# Altium schematic sheet 34.SchDoc
size 513 x 386 mm
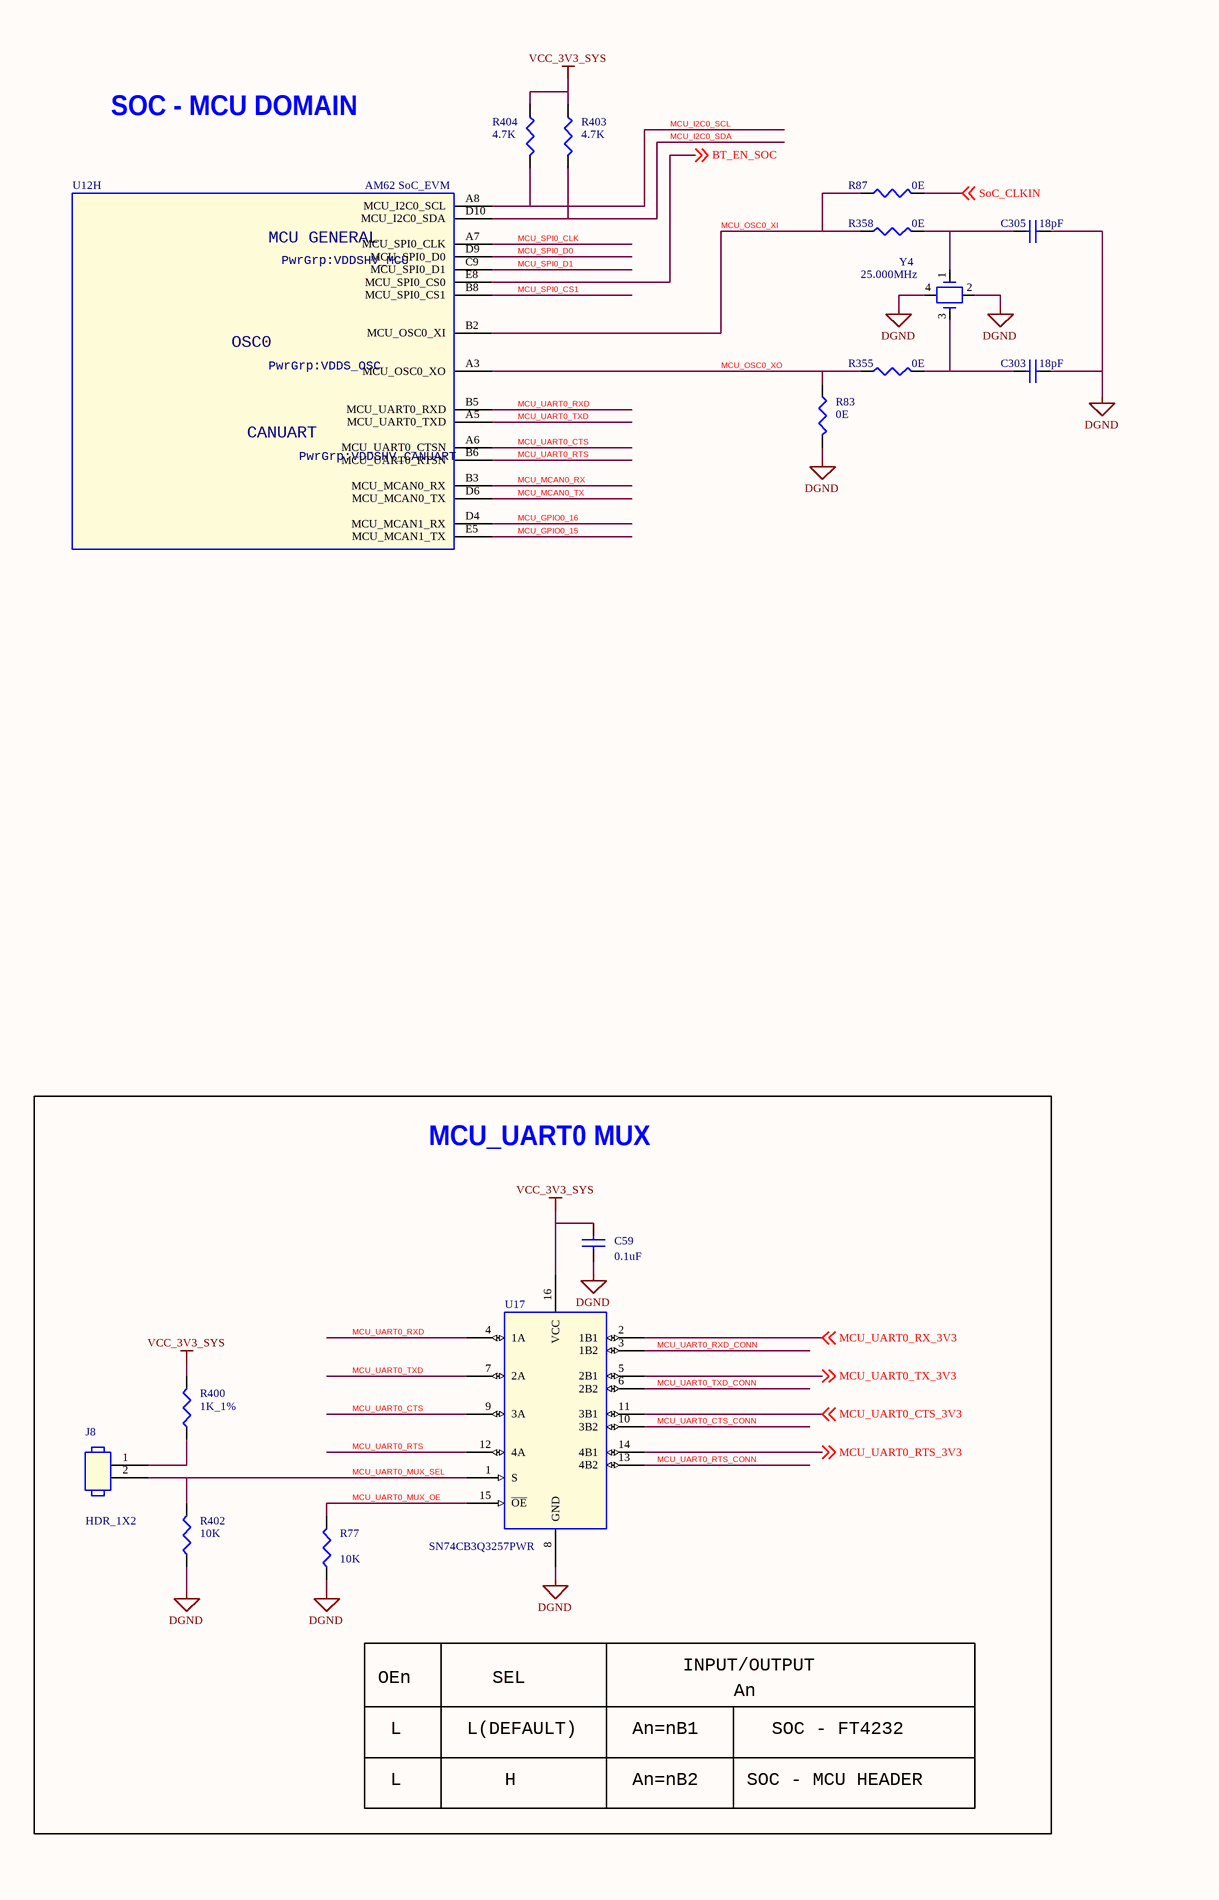
[diagram p0: 34.SchDoc, left]
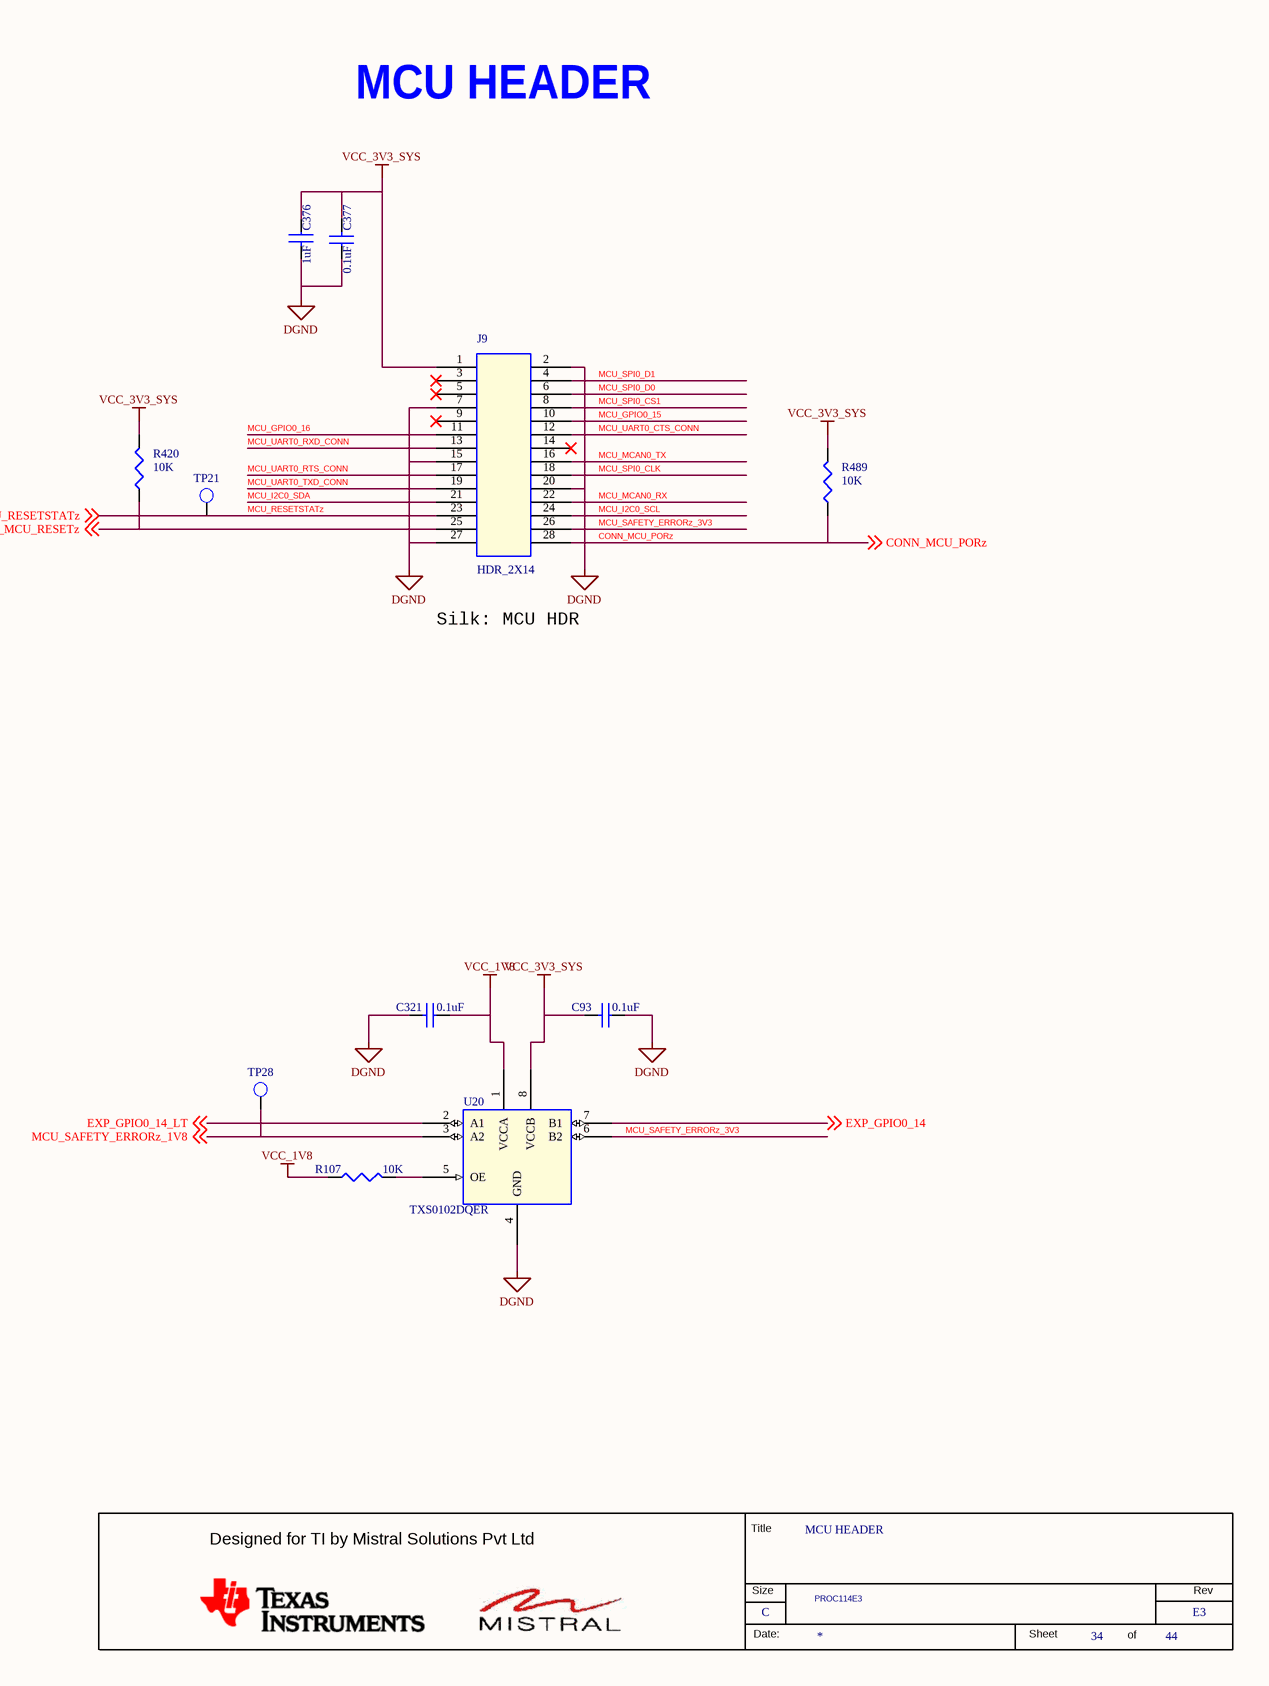
[diagram p1: 34.SchDoc, right]

## Parts
*  RevCode: E3  Title: MCU HEADER  Page Size: C  Page Number: 34  Page Count: 44  Variant Name: PROC114E3  (hidden comment: MISTRAL_TITLEBLK_CSIZE)  (graphical)
C59  0.1uF  [CAP0402_0-75]
C93  0.1uF  [CAP0201_0-5]
C303  18pF  [CAP0402_0-75]
C305  18pF  [CAP0402_0-75]
C321  0.1uF  [CAP0201_0-5]
C376  1uF  [CAP0201_0-5]
C377  0.1uF  [CAP0402_0-75]
J8  HDR_1X2  [HDR_1X2_90120-0122_S_T_5-6]
J9  HDR_2X14  [HDR_14X2_100_S_T]
R77  10K  [RES0201_0-5]
R83  0E  [RES0201_0-5]
R87  0E  [RES0201_0-5]
R107  10K  [RES0201_0-5]
R355  0E  [RES0402_0-5]
R358  0E  [RES0402_0-5]
R400  1K_1%  [RES0402_0-5]
R402  10K  [RES0201_0-5]
R403  4.7K  [RES0201_0-5]
R404  4.7K  [RES0201_0-5]
R420  10K  [RES0201_0-5]
R489  10K  [RES0201_0-5]
TP21  TP20_SMD  [TP20_SMD]  (value not drawn)
TP28  TP20_SMD  [TP20_SMD]  (value not drawn)
U12  AM62 SoC_EVM  [BGA425_19-68_510X510_0-7]  (part H of 18)
U17  SN74CB3Q3257PWR  [TSSOP16_25-59_205X180]
U20  TXS0102DQER  [X2SON8_TXS0102_40X60_0-4]
Y4  25.000MHz  [XTAL4_XRCGB-FM_80X60_SMD_0-7]

## Blocks framed on the sheet
MCU_UART0 MUX: C59 J8 R77 R400 R402 U17

## Nets
DGND: C59.1 C93.1 C303.1 C305.1 C321.2 C376.2 C377.1 J9.2 J9.7 J9.15 J9.20 J9.27 R77.2 R83.1 R402.1 U17.8(GND) U20.4(GND) Y4.2 Y4.4
VCC_1V8: C321.1 R107.1 U20.1(VCCA)
VCC_3V3_SYS: C59.2 C93.2 C376.1 C377.2 J9.1 R400.2 R403.1 R404.1 R420.2 R489.2 U17.16(VCC) U20.8(VCCB)
BT_EN_SOC: U12.E8(MCU_SPI0_CS0) ; off-sheet BT_EN_SOC
CONN_MCU_PORz: J9.28 R489.1 ; off-sheet CONN_MCU_PORz
CONN_MCU_RESETz: J9.25 R420.1 ; off-sheet CONN_MCU_RESETz
EXP_GPIO0_14: U20.7(B1) ; off-sheet EXP_GPIO0_14
EXP_GPIO0_14_LT: U20.2(A1) ; off-sheet EXP_GPIO0_14_LT
MCU_GPIO0_15: J9.10 U12.E5(MCU_MCAN1_TX)
MCU_GPIO0_16: J9.11 U12.D4(MCU_MCAN1_RX)
MCU_I2C0_SCL: J9.24 R404.2 U12.A8(MCU_I2C0_SCL)
MCU_I2C0_SDA: J9.21 R403.2 U12.D10(MCU_I2C0_SDA)
MCU_MCAN0_RX: J9.22 U12.B3(MCU_MCAN0_RX)
MCU_MCAN0_TX: J9.16 U12.D6(MCU_MCAN0_TX)
MCU_OSC0_XI: R87.2 R358.2 U12.B2(MCU_OSC0_XI)
MCU_OSC0_XO: R83.2 R355.2 U12.A3(MCU_OSC0_XO)
MCU_RESETSTATz: J9.23 TP21.1(TP) ; off-sheet MCU_RESETSTATz
MCU_SAFETY_ERRORz_1V8: TP28.1(TP) U20.3(A2) ; off-sheet MCU_SAFETY_ERRORz_1V8
MCU_SAFETY_ERRORz_3V3: J9.26 U20.6(B2)
MCU_SPI0_CLK: J9.18 U12.A7(MCU_SPI0_CLK)
MCU_SPI0_CS1: J9.8 U12.B8(MCU_SPI0_CS1)
MCU_SPI0_D0: J9.6 U12.D9(MCU_SPI0_D0)
MCU_SPI0_D1: J9.4 U12.C9(MCU_SPI0_D1)
MCU_UART0_CTS: U12.A6(MCU_UART0_CTSN) U17.9(3A)
MCU_UART0_CTS_3V3: U17.11(3B1) ; off-sheet MCU_UART0_CTS_3V3
MCU_UART0_CTS_CONN: J9.12 U17.10(3B2)
MCU_UART0_MUX_OE: R77.1 U17.15(~{OE})
MCU_UART0_MUX_SEL: J8.2 R402.2 U17.1(S)
MCU_UART0_RTS: U12.B6(MCU_UART0_RTSN) U17.12(4A)
MCU_UART0_RTS_3V3: U17.14(4B1) ; off-sheet MCU_UART0_RTS_3V3
MCU_UART0_RTS_CONN: J9.17 U17.13(4B2)
MCU_UART0_RX_3V3: U17.2(1B1) ; off-sheet MCU_UART0_RX_3V3
MCU_UART0_RXD: U12.B5(MCU_UART0_RXD) U17.4(1A)
MCU_UART0_RXD_CONN: J9.13 U17.3(1B2)
MCU_UART0_TX_3V3: U17.5(2B1) ; off-sheet MCU_UART0_TX_3V3
MCU_UART0_TXD: U12.A5(MCU_UART0_TXD) U17.7(2A)
MCU_UART0_TXD_CONN: J9.19 U17.6(2B2)
SoC_CLKIN: R87.1 ; off-sheet SoC_CLKIN
NetC303_2: C303.2 R355.1 Y4.3
NetC305_2: C305.2 R358.1 Y4.1
NetJ8_1: J8.1 R400.1
NetR107_2: R107.2 U20.5(OE)

Not connected (* = marked no-connect by the designer): J9 3* 5* 9* 14*

## Notes on the sheet
- SOC - MCU DOMAIN
- MCU HEADER
- Silk: MCU HDR
- OEn
- SEL
- INPUT/OUTPUT
- L
- L(DEFAULT)
- An=nB1
- An
- SOC - FT4232
- H
- An=nB2
- SOC - MCU HEADER
- (in symbol AM62-EVM_BGA425, part H) MCU GENERAL; PwrGrp:VDDSHV_MCU; OSC0; PwrGrp:VDDS_OSC; CANUART; PwrGrp:VDDSHV_CANUART
- (in symbol MISTRAL_TITLEBLK_CSIZE) Title; Designed for TI by Mistral Solutions Pvt Ltd; Size; Rev; Date:; Sheet; of

## Library data of the parts
* = MISTRAL_TITLEBLK_CSIZE: Issue: 1.0; Page Create Date: March  8, 1995; Page Modify Date: *; Schematic Page Count: 44; Schematic Page Number: 34
C59 = CAP_Dup2: CAP CERAMIC 0.1uF 50V 10% X7R 0402; Alt_Mfr_part_number: CC0402KRX5R8BB104; Mistral Part No: 120011100014-R; Mfr_name: MURATA; Mfr_part_number: GRM155R71H104KE14D; Part_type: CAPACITORS\CERAMIC; Alt_Mfr_name: YAGEO AMERICA; Project: J7_CP; Wattage: NA; Customs_HS_Code: 85322990; Custom_Duty: 15%; PCB Footprint: CAP0402_0-75; Tolerance: 10%; Voltage: 50V; Package: 0402; Distributor_name: DIGIKEY; Distributor_part_number: 490-10700-1-ND; Height: 0.55MM; Weight: 3.1mg; Temperature: -55°C+125°C; Datasheet: Y:\MIS_DATABASE\DATASHEETS\CAPACITORS\GRM155R71H104KE14.PDF; Crtd /date: ALVY/211020; Chkd/date: MANIRAJA/261020; MECHANICAL 3D STEP FILE: CAP0402_0-75; Library Ref: CAP; Footprint Ref: CAP0402_0-75; Library Path: Y:\MIS_DATABASE\Library\ALTIUM_TOOL\SCHEMATICS_PARTS\MS_DISCRETE_Library.schlib; Footprint Path: Y:\MIS_DATABASE\Library\ALTIUM_TOOL\PCB_FOOTPRINTS\Altium_Footprint_Lib.PcbLib
C93 C321 = CAP_Dup2: CAP CERAMIC 0.1uF 16V 10% X5R 0201; Alt_Mfr_part_number: CC0402KRX5R8BB104; Mistral Part No: 120009030072-R; Mfr_name: MURATA; Mfr_part_number: GRM033R61C104KE14D; Part_type: CAPACITORS\CERAMIC; Alt_Mfr_name: YAGEO AMERICA; Project: TI_MAXIE_CPB; Wattage: NA; Customs_HS_Code: 85322990; Custom_Duty: 15%; PCB Footprint: CAP0201_0-5; Tolerance: 10%; Voltage: 16V; Package: 0201; Distributor_name: DIGIKEY; Distributor_part_number: 490-14305-1-ND; Height: 0.33MM; Weight: 0.33mg; Temperature: -55°C+85°C; Datasheet: Y:\MIS_DATABASE\DATASHEETS\CAPACITORS\GRM033R61C104KE14.PDF; Crtd /date: MANIRAJA/230118; Chkd/date: MANIRAJA/230118; MECHANICAL 3D STEP FILE: CAP0201_0-5; Library Ref: CAP; Footprint Ref: CAP0201_0-5; Library Path: Y:\MIS_DATABASE\Library\ALTIUM_TOOL\SCHEMATICS_PARTS\MS_DISCRETE_Library.schlib; Footprint Path: Y:\MIS_DATABASE\Library\ALTIUM_TOOL\PCB_FOOTPRINTS\Altium_Footprint_Lib.PcbLib
C303 C305 = CAP_Dup2: CAP CERAMIC 18pF 50V 5% HI-Q C0G(NP0) 0402; Part_type: CAPACITORS\CERAMIC; Mfr_part_number: GJM1555C1H180JB01D; Mfr_name: MURATA; Mistral Part No: 120014100019-R; Custom_Duty: 15%; Customs_HS_Code: 85322990; Wattage: NA; Project: DC_MIST_RDC; Footprint Path: Y:\MIS_DATABASE\Library\ALTIUM_TOOL\PCB_FOOTPRINTS\Altium_Footprint_Lib.PcbLib; Library Path: Y:\MIS_DATABASE\Library\ALTIUM_TOOL\SCHEMATICS_PARTS\MS_DISCRETE_Library.schlib; MECHANICAL 3D STEP FILE: CAP0402_0-75; Chkd/date: VASANTHA/030315; Crtd /date: NAVEED/271014; Datasheet: Y:\MIS_DATABASE\DATASHEETS\CAPACITORS\MURATA-GXX-SER_NOV17.PDF; Temperature: -55°C+125°C; Weight: 6mg; Height: 0.55MM; Library Ref: CAP; Distributor_part_number: 490-3119-1-ND; Distributor_name: DIGIKEY; Package: 0402; Voltage: 50V; Tolerance: 5%; Footprint Ref: CAP0402_0-75; PCB Footprint: CAP0402_0-75
C376 = CAP_Dup2: CAP CERAMIC 1uF 16V 20% X5R 0201; Mistral Part No: 120018090038-R; Mfr_name: MURATA; Mfr_part_number: GRM033R61C105ME15D; Part_type: CAPACITORS\CERAMIC; Project: QCS610_NANOSOM; Customs_HS_Code: 85322990; Custom_Duty: 15%; Wattage: NA; Tolerance: 20%; Voltage: 16V; Package: 0201; Distributor_name: DIGIKEY; Distributor_part_number: 490-18654-1-ND; Height: 0.39MM; Weight: 0.33mg; Temperature: -55°C+85°C; Datasheet: Y:\MIS_DATABASE\DATASHEETS\CAPACITORS\GRM033R61C105ME15.PDF; Crtd /date: ALVY/260520; Chkd/date: MANIRAJA/300520; MECHANICAL 3D STEP FILE: CAP0201_0-5; Library Path: Y:\MIS_DATABASE\Library\ALTIUM_TOOL\SCHEMATICS_PARTS\MS_DISCRETE_Library.schlib; Footprint Path: Y:\MIS_DATABASE\Library\ALTIUM_TOOL\PCB_FOOTPRINTS\Altium_Footprint_Lib.PcbLib; Library Ref: CAP; Footprint Ref: CAP0201_0-5; PCB Footprint: CAP0201_0-5
C377 = CAP_Dup2: CAP CERAMIC 0.1uF 50V 10% X7R 0402; Alt_Mfr_name: YAGEO AMERICA; Part_type: CAPACITORS\CERAMIC; Mfr_part_number: GRM155R71H104KE14D; Mfr_name: MURATA; Mistral Part No: 120011100014-R; Alt_Mfr_part_number: CC0402KRX5R8BB104; Custom_Duty: 15%; Customs_HS_Code: 85322990; Wattage: NA; Project: J7_CP; Footprint Path: Y:\MIS_DATABASE\Library\ALTIUM_TOOL\PCB_FOOTPRINTS\Altium_Footprint_Lib.PcbLib; Library Path: Y:\MIS_DATABASE\Library\ALTIUM_TOOL\SCHEMATICS_PARTS\MS_DISCRETE_Library.schlib; Footprint Ref: CAP0402_0-75; Library Ref: CAP; MECHANICAL 3D STEP FILE: CAP0402_0-75; Chkd/date: MANIRAJA/261020; Crtd /date: ALVY/211020; Datasheet: Y:\MIS_DATABASE\DATASHEETS\CAPACITORS\GRM155R71H104KE14.PDF; Temperature: -55°C+125°C; Weight: 3.1mg; Height: 0.55MM; Distributor_part_number: 490-10700-1-ND; Distributor_name: DIGIKEY; Package: 0402; Voltage: 50V; Tolerance: 10%; PCB Footprint: CAP0402_0-75
J8 = HEADER_2X1: CON HDR 1X2 2.54MM PITCH ST TH; Part_type: CONNECTOR\HEADERS; Mfr_part_number: 90120-0122; Mfr_name: MOLEX; Mistral Part No: 150012100005-R; Custom_Duty: 24%; Customs_HS_Code: 85369090; Project: NPOL_FEP; Tolerance: NA; Chkd/date: NAVEED/210714; Crtd /date: USMAN/031012; Datasheet: Y:\MIS_DATABASE\DATASHEETS\CONNECTORS\90120-XX.PDF; Height: 5.60MM; Distributor_part_number: WM8072-ND; Distributor_name: DIGIKEY; Package: THRU-HOLE; Voltage: NA; Wattage: NA; Weight: 122mg; Temperature: -55°C+125°C; MECHANICAL 3D STEP FILE: HDR_1X2_90120-0122_S_T_5-6; Library Path: Y:\MIS_DATABASE\Library\ALTIUM_TOOL\SCHEMATICS_PARTS\MS_CONNECTOR_Library.schlib; Footprint Path: Y:\MIS_DATABASE\Library\ALTIUM_TOOL\PCB_FOOTPRINTS\Altium_Footprint_Lib.PcbLib; Library Ref: HEADER_2X1; Footprint Ref: HDR_1X2_90120-0122_S_T_5-6; PCB Footprint: HDR_1X2_90120-0122_S_T_5-6
J9 = HEADER_14x2: CON HDR 2X14 2.54MM PITCH ST TH; Part_type: CONNECTOR\HEADERS; Mfr_part_number: PREC014DAAN-RC; Mfr_name: SULLINS; Mistral Part No: 150014110005-R; Custom_Duty: 0.24; Customs_HS_Code: 85369090; Wattage: NA; Project: GALILEO_EVM; Chkd/date: NAVEED/280515; Crtd /date: VASANTHA/111114; Datasheet: Y:\MIS_DATABASE\DATASHEETS\CONNECTORS\PRXXXN-RC.PDF; Temperature: -40°C+105°C; Weight: NA; Height: 8.34MM; Library Ref: HEADER_14x2; Distributor_part_number: S2012EC-14-ND; Distributor_name: DIGIKEY; Package: THRU-HOLE; Voltage: NA; Tolerance: NA; PCB Footprint: HDR_14X2_100_S_T
R77 R107 R420 = RESISTOR_Dup6: RES 10K 1/20W 5% 0201; Part_type: RESISTORS\FIXED; Mfr_part_number: RC0201JR-0710KL; Mfr_name: YAGEO AMERICA; Mistral Part No: 110010070051-R; Custom_Duty: 15%; Customs_HS_Code: 85332119; Voltage: NA; Project: GOLDEN-I LITE; Footprint Path: Y:\MIS_DATABASE\Library\ALTIUM_TOOL\PCB_FOOTPRINTS\Altium_Footprint_Lib.PcbLib; Library Path: Y:\MIS_DATABASE\Library\ALTIUM_TOOL\SCHEMATICS_PARTS\MS_DISCRETE_Library.schlib; Footprint Ref: RES0201_0-5; Library Ref: RESISTOR; MECHANICAL 3D STEP FILE: RES0201_0-5; Chkd/date: MANIRAJA/050517; Crtd /date: MANIRAJA/050517; Datasheet: Y:\MIS_DATABASE\DATASHEETS\RESISTORS\RCXXXXL-SER_MAR18.PDF; Temperature: -55°C+125°C; Weight: 0.17mg; Height: 0.26MM; Distributor_part_number: 311-10KNCT-ND; Distributor_name: DIGIKEY; Package: 0201; Wattage: 1/20W; Tolerance: 5%; PCB Footprint: RES0201_0-5
R83 R87 = RESISTOR_Dup4: RES 0E 1/20W 5% 0201; Mistral Part No: 110010070067-R; Mfr_name: YAGEO AMERICA; Mfr_part_number: RC0201JR-070RL; Part_type: RESISTORS\FIXED; Project: PB_BUGBASE; Voltage: NA; Customs_HS_Code: 85332119; Custom_Duty: 15%; PCB Footprint: RES0201_0-5; Footprint Path: Y:\MIS_DATABASE\Library\ALTIUM_TOOL\PCB_FOOTPRINTS\Altium_Footprint_Lib.PcbLib; Library Path: Y:\MIS_DATABASE\Library\ALTIUM_TOOL\SCHEMATICS_PARTS\MS_DISCRETE_Library.schlib; Footprint Ref: RES0201_0-5; Library Ref: RESISTOR; Tolerance: 5%; Wattage: 1/20W; Package: 0201; Distributor_name: DIGIKEY; Distributor_part_number: 311-0.0NCT-ND; Height: 0.26MM; Weight: 0.17mg; Temperature: -55°C+125°C; Datasheet: Y:\MIS_DATABASE\DATASHEETS\RESISTORS\RCXXXXL-SER_MAR18.PDF; Crtd /date: MUDDU/120710; Chkd/date: NAVEED/301214; MECHANICAL 3D STEP FILE: RES0201_0-5
R355 R358 = RESISTOR_Dup4: RES 0E 1/16W JUMPER 0402; Part_type: RESISTORS\FIXED; Mfr_part_number: CRCW04020000Z0ED; Mfr_name: VISHAY; Mistral Part No: 110010080019-R; Custom_Duty: 15%; Customs_HS_Code: 85332119; Voltage: NA; Project: PB_BUGBASE; PCB Footprint: RES0402_0-5; MECHANICAL 3D STEP FILE: RES0402_0-5; Chkd/date: VASANTHA/201216; Crtd /date: MUDDU/190810; Datasheet: Y:\MIS_DATABASE\DATASHEETS\RESISTORS\CRCW0603.PDF; Temperature: -55°C+155°C; Weight: 0.65mg; Height: 0.40MM; Distributor_part_number: 541-0.0JCT-ND; Distributor_name: DIGIKEY; Package: 0402; Wattage: 1/16W; Tolerance: NA; Library Ref: RESISTOR; Footprint Ref: RES0402_0-5; Library Path: Y:\MIS_DATABASE\Library\ALTIUM_TOOL\SCHEMATICS_PARTS\MS_DISCRETE_Library.schlib; Footprint Path: Y:\MIS_DATABASE\Library\ALTIUM_TOOL\PCB_FOOTPRINTS\Altium_Footprint_Lib.PcbLib
R400 = RESISTOR_Dup4: RES 1K 1/10W 1% 0402; Part_type: RESISTORS\FIXED; Mfr_part_number: ERJ-2RKF1001X; Mfr_name: PANASONIC-ECG; Mistral Part No: 110009030411-R; Custom_Duty: 15%; Customs_HS_Code: 85332119; Voltage: NA; Project: VOCERA; Chkd/date: VASANTHA/281216; Crtd /date: MAZHAR/150506; Datasheet: Y:\MIS_DATABASE\DATASHEETS\RESISTORS\PAN-ERJSER_NOV17.PDF; Temperature: -55°C+155°C; Weight: 0.8mg; Height: 0.40MM; Distributor_part_number: P1.00KLCT-ND; Distributor_name: DIGIKEY; Package: 0402; Wattage: 1/10W; Tolerance: 1%; Library Ref: RESISTOR; Footprint Ref: RES0402_0-5; MECHANICAL 3D STEP FILE: RES0402_0-5; Library Path: Y:\MIS_DATABASE\Library\ALTIUM_TOOL\SCHEMATICS_PARTS\MS_DISCRETE_Library.schlib; Footprint Path: Y:\MIS_DATABASE\Library\ALTIUM_TOOL\PCB_FOOTPRINTS\Altium_Footprint_Lib.PcbLib; PCB Footprint: RES0402_0-5
R402 R489 = RESISTOR_Dup6: RES 10K 1/20W 5% 0201; Mistral Part No: 110010070051-R; Mfr_name: YAGEO AMERICA; Mfr_part_number: RC0201JR-0710KL; Part_type: RESISTORS\FIXED; Project: GOLDEN-I LITE; Voltage: NA; Customs_HS_Code: 85332119; Custom_Duty: 15%; Footprint Ref: RES0201_0-5; Tolerance: 5%; Wattage: 1/20W; Package: 0201; Distributor_name: DIGIKEY; Distributor_part_number: 311-10KNCT-ND; Library Ref: RESISTOR; Height: 0.26MM; Weight: 0.17mg; Temperature: -55°C+125°C; Datasheet: Y:\MIS_DATABASE\DATASHEETS\RESISTORS\RCXXXXL-SER_MAR18.PDF; Crtd /date: MANIRAJA/050517; Chkd/date: MANIRAJA/050517; MECHANICAL 3D STEP FILE: RES0201_0-5; Library Path: Y:\MIS_DATABASE\Library\ALTIUM_TOOL\SCHEMATICS_PARTS\MS_DISCRETE_Library.schlib; Footprint Path: Y:\MIS_DATABASE\Library\ALTIUM_TOOL\PCB_FOOTPRINTS\Altium_Footprint_Lib.PcbLib; PCB Footprint: RES0201_0-5
R403 = RESISTOR_Dup6: RES 4.7K 1/20W 5% 0201; Part_type: RESISTORS\FIXED; Mfr_part_number: RC0201JR-074K7L; Mfr_name: YAGEO AMERICA; Mistral Part No: 110021090007-R; Custom_Duty: 15%; Customs_HS_Code: 85332119; Voltage: NA; Project: TI_AM62x SKEVM_BRD; PCB Footprint: RES0201_0-5; Footprint Path: Y:\MIS_DATABASE\Library\ALTIUM_TOOL\PCB_FOOTPRINTS\Altium_Footprint_Lib.PcbLib; Library Path: Y:\MIS_DATABASE\Library\ALTIUM_TOOL\SCHEMATICS_PARTS\MS_DISCRETE_Library.schlib; MECHANICAL 3D STEP FILE: RES0201_0-5; Chkd/date: MANIRAJA/200921; Crtd /date: ALVY/200921; Datasheet: Y:\MIS_DATABASE\DATASHEETS\RESISTORS\RCXXXXL-SER_MAR18.PDF; Temperature: -55°C+125°C; Weight: 0.17mg; Height: 0.26MM; Library Ref: RESISTOR; Distributor_part_number: 311-4.7KNCT-ND; Distributor_name: DIGIKEY; Package: 0201; Wattage: 1/20W; Tolerance: 5%; Footprint Ref: RES0201_0-5
R404 = RESISTOR_Dup6: RES 4.7K 1/20W 5% 0201; Mistral Part No: 110021090007-R; Mfr_name: YAGEO AMERICA; Mfr_part_number: RC0201JR-074K7L; Part_type: RESISTORS\FIXED; Project: TI_AM62x SKEVM_BRD; Voltage: NA; Customs_HS_Code: 85332119; Custom_Duty: 15%; PCB Footprint: RES0201_0-5; Footprint Ref: RES0201_0-5; Tolerance: 5%; Wattage: 1/20W; Package: 0201; Distributor_name: DIGIKEY; Distributor_part_number: 311-4.7KNCT-ND; Library Ref: RESISTOR; Height: 0.26MM; Weight: 0.17mg; Temperature: -55°C+125°C; Datasheet: Y:\MIS_DATABASE\DATASHEETS\RESISTORS\RCXXXXL-SER_MAR18.PDF; Crtd /date: ALVY/200921; Chkd/date: MANIRAJA/200921; MECHANICAL 3D STEP FILE: RES0201_0-5; Library Path: Y:\MIS_DATABASE\Library\ALTIUM_TOOL\SCHEMATICS_PARTS\MS_DISCRETE_Library.schlib; Footprint Path: Y:\MIS_DATABASE\Library\ALTIUM_TOOL\PCB_FOOTPRINTS\Altium_Footprint_Lib.PcbLib
TP21 = TESTPOINT: TESTPOINT CIR 20 SMD; Mfr_name: LOCAL; Custom_Duty: NA; Project: BT MODULE_CSRBC04; Customs_HS_Code: NA; RoHS: NA; Footprint Ref: TP20_SMD; Library Ref: TESTPOINT; Footprint Path: Y:\MIS_DATABASE\Library\ALTIUM_TOOL\PCB_FOOTPRINTS\Altium_Footprint_Lib.PcbLib; Library Path: Y:\MIS_DATABASE\Library\ALTIUM_TOOL\SCHEMATICS_PARTS\MS_DISCRETE_Library.schlib; MECHANICAL 3D STEP FILE: NA; Datasheet: NA; Temperature: NA; Weight: NA; Wattage: NA; Voltage: NA; Tolerance: NA; Chkd/date: SHREESHAIL/171006; Crtd /date: MAZHAR/171006; Height: NA; Distributor_part_number: NA; Distributor_name: NA; Package: SMD; Part_type: TESTPOINT; Mfr_part_number: TP20_SMD; Mistral Part No: NA; PCB Footprint: TP20_SMD
TP28 = TESTPOINT: TESTPOINT CIR 20 SMD; Mistral Part No: NA; Mfr_name: LOCAL; Project: BT MODULE_CSRBC04; PCB Footprint: TP20_SMD; Mfr_part_number: TP20_SMD; Part_type: TESTPOINT; Package: SMD; Distributor_name: NA; Distributor_part_number: NA; Height: NA; Crtd /date: MAZHAR/171006; Chkd/date: SHREESHAIL/171006; Tolerance: NA; Voltage: NA; Wattage: NA; Weight: NA; Temperature: NA; Datasheet: NA; MECHANICAL 3D STEP FILE: NA; Library Path: Y:\MIS_DATABASE\Library\ALTIUM_TOOL\SCHEMATICS_PARTS\MS_DISCRETE_Library.schlib; Footprint Path: Y:\MIS_DATABASE\Library\ALTIUM_TOOL\PCB_FOOTPRINTS\Altium_Footprint_Lib.PcbLib; Library Ref: TESTPOINT; Footprint Ref: TP20_SMD; RoHS: NA; Customs_HS_Code: NA; Custom_Duty: NA
U12 = AM62-EVM_BGA425: IC AM62 SoC MICROPROCESSOR BGA425; Mistral Part No: 141221060001; Mfr_name: TEXAS INSTRUMENTS; Part_type: ICS\DIGITAL\MICROPROCESSOR; Project: AM62_EVM_BRD; Tolerance: NA; Customs_HS_Code: 85423100; Custom_Duty: 15%; PCB Footprint: BGA425_19-68_510X510_0-7; Mfr_part_number: AM62 SoC_EVM; Voltage: NA; Wattage: NA; Package: BGA425; Distributor_name: NA; Distributor_part_number: NA; Library Ref: AM62-EVM_BGA425; Footprint Ref: BGA425_19-68_510X510_0-7; Height: 0.65MM; Weight: NA; Temperature: NA; Datasheet: Y:\MIS_DATABASE\DATASHEETS\ICS\DIGITAL\MICROCONTROLLER\AM62-SoC_SVB.PDF; Crtd /date: MANIRAJA/110621; Chkd/date: ALVY/110621; RoHS: NA; MECHANICAL 3D STEP FILE: BGA425_19-68_510X510_0-7; Library Path: Y:\MIS_DATABASE\Library\ALTIUM_TOOL\SCHEMATICS_PARTS\MS_MICROPROCESSOR_Library.schlib; Footprint Path: Y:\MIS_DATABASE\Library\ALTIUM_TOOL\PCB_FOOTPRINTS\Altium_Footprint_Lib.PcbLib
U17 = SN74CB3Q3257PWR_TSSOP16: IC 4BIT 1-OF-2 FET MULTIPLEXER/DEMULTIPLEXER TSSOP16; Part_type: ICS\DIGITAL\COMBINATIONAL; Mfr_name: TEXAS INSTRUMENTS; Mistral Part No: 141009030117-R; Custom_Duty: 15%; Customs_HS_Code: 85423100; Project: OMAP_EVM; RoHS: Sb/ Br FREE; Chkd/date: SUHAS/251010; Crtd /date: USMAN/060109; Datasheet: Y:\MIS_DATABASE\DATASHEETS\ICS\DIGITAL\COMBINATIONAL\SN74CB3Q3257.PDF; Temperature: -40°C+85°C; Height: 1.20MM; Library Ref: SN74CB3Q3257PWR_TSSOP16; Distributor_part_number: 296-19138-1-ND; Distributor_name: DIGIKEY; Package: TSSOP16; Mfr_part_number: SN74CB3Q3257PWR; PCB Footprint: TSSOP16_25-59_205X180
U20 = TXS0102DQX_SON8: IC 2-BIT BI-DIR VOLTAGE-LEVEL TRANSLATOR FOR OPEN-DRAIN AND PUSH-PULL X2SON8; Part_type: ICS\INTERFACE\LEVEL TRANSLATOR; Mfr_name: TEXAS INSTRUMENTS; Mistral Part No: 141012050010-R; Custom_Duty: 15%; Customs_HS_Code: 85423100; Wattage: NA; Project: GEN_3-8_DB; PCB Footprint: X2SON8_TXS0102_40X60_0-4; Footprint Path: Y:\MIS_DATABASE\Library\ALTIUM_TOOL\PCB_FOOTPRINTS\Altium_Footprint_Lib.PcbLib; Library Path: Y:\MIS_DATABASE\Library\ALTIUM_TOOL\SCHEMATICS_PARTS\MS_MISCINTERFACE_Library.schlib; MECHANICAL 3D STEP FILE: X2SON8_TXS0102_40X60_0-4; Chkd/date: MANIRAJA/010719; Crtd /date: CHAITHANYA230512; Datasheet: Y:\MIS_DATABASE\DATASHEETS\ICS\INTERFACE\TXS0102-SER.PDF; Temperature: -40°C+85°C; Weight: 1.2mg; Height: 0.40MM; Library Ref: TXS0102DQX_SON8; Distributor_part_number: 296-28368-1-ND; Distributor_name: DIGIKEY; Package: X2SON8; Voltage: NA; Tolerance: NA; Mfr_part_number: TXS0102DQER; Footprint Ref: X2SON8_TXS0102_40X60_0-4
Y4 = CRY4_13: CRY 25.000MHz 6pF SMD; Mistral Part No: 130020100043-R; Mfr_name: MURATA; Mfr_part_number: XRCGB25M000F3M00R0; Part_type: CRYSTAL; Project: AM64X_SKEVM; Tolerance: NA; Customs_HS_Code: 85439000; Custom_Duty: 24%; PCB Footprint: XTAL4_XRCGB-FM_80X60_SMD_0-7; Footprint Ref: XTAL4_XRCGB-FM_80X60_SMD_0-7; Voltage: NA; Wattage: NA; Package: SMD; Distributor_name: DIGIKEY; Distributor_part_number: 490-5578-1-ND; Library Ref: CRY4_13; Height: 0.70MM; Weight: 23mg; Temperature: -30°C+85°C; Datasheet: Y:\MIS_DATABASE\DATASHEETS\MISC\CRY_OSC\XRCGB.PDF; Crtd /date: ALVY/151020; Chkd/date: MANIRAJA/151020; MECHANICAL 3D STEP FILE: XTAL4_XRCGB-FM_80X60_SMD_0-7; Library Path: Y:\MIS_DATABASE\Library\ALTIUM_TOOL\SCHEMATICS_PARTS\MS_DISCRETE_Library.schlib; Footprint Path: Y:\MIS_DATABASE\Library\ALTIUM_TOOL\PCB_FOOTPRINTS\Altium_Footprint_Lib.PcbLib